# Altium schematic sheet ocxo.SchDoc: OCXO
size Letter; CheckedBy: J. Brinton; CompanyName: Signal Laboratories, Inc.; DrawnBy: J. Brinton; Engineer: J. Brinton; Address1: 3479 Edison Way; Address2: Menlo Park CA 94025; Address3: +1 (877) 778-8435; Address4: siglabs.com; Revision: 3; SheetNumber: 36; SheetTotal: 49
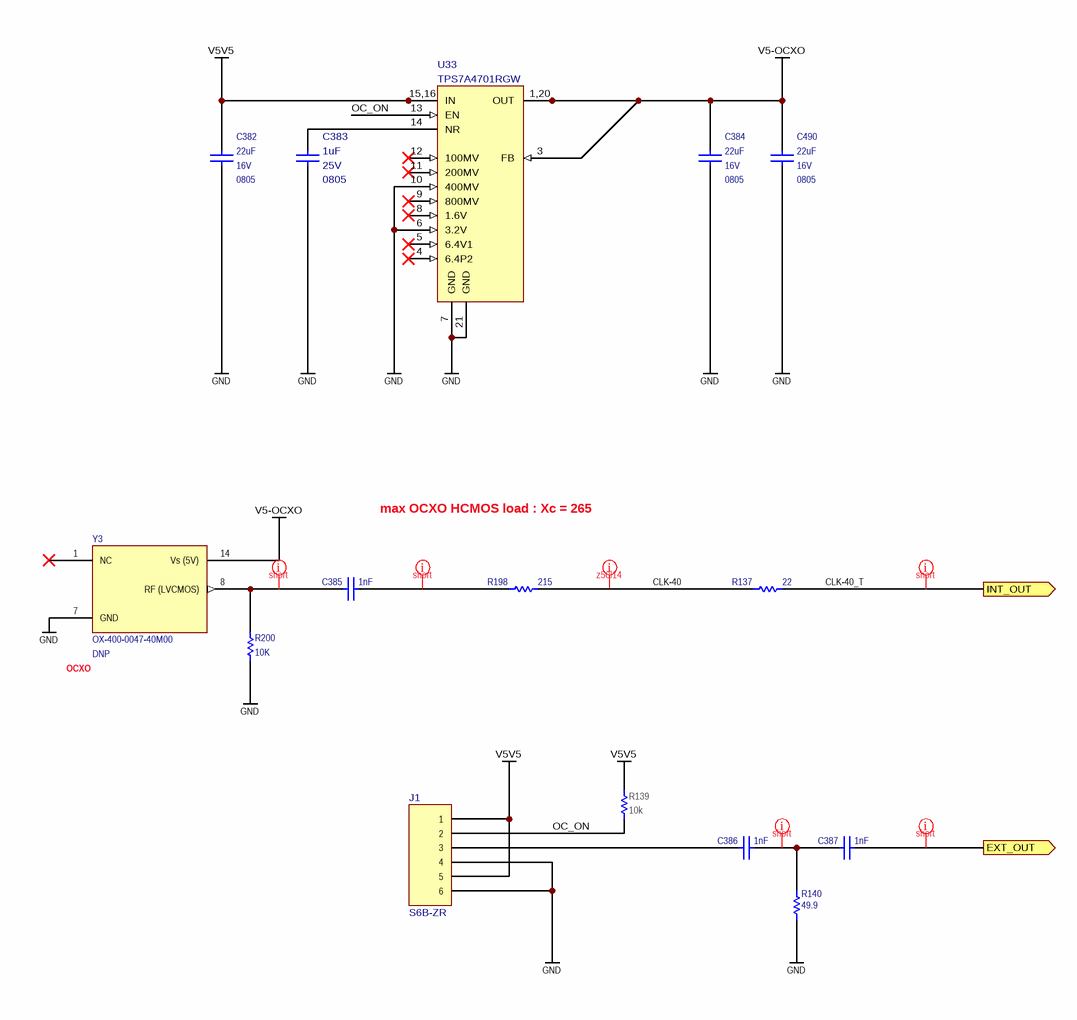
[diagram p0: ocxo.SchDoc]

## Parts
C382  value 22uF  Voltage: 16V  Package: 0805  [CAPC200X125X145L45N]  (hidden comment: CL21A226KOQNNNE)
C383  value 1uF  Package: 0805  Voltage: 25V  [CAPC200X125X145L45N]  (hidden comment: TMK212B7105KG)
C384  value 22uF  Voltage: 16V  Package: 0805  [CAPC200X125X145L45N]  (hidden comment: CL21A226KOQNNNE)
C385  value 1nF  [CAPC100X50X55L25N]  (hidden comment: CGA2B2NP01H102J050BA)
C386  value 1nF  [CAPC100X50X55L25N]  (hidden comment: CGA2B2NP01H102J050BA)
C387  value 1nF  [CAPC100X50X55L25N]  (hidden comment: CGA2B2NP01H102J050BA)
C490  value 22uF  Voltage: 16V  Package: 0805  [CAPC200X125X145L45N]  (hidden comment: CL21A226KOQNNNE)
J1  S6B-ZR  [S6B-ZR]
R137  value 22  [RESC1005X40N]  (hidden comment: RC0402FR-0722RL)
R139  value 10k  [RESC1005X40N]  (hidden comment: ERJ-2RKF1002X)
R140  value 49.9  [RESC1005X40N]  (hidden comment: ERA-2AEB49R9X)
R198  value 215  [RESC1005X40N]  (hidden comment: RC0402FR-07215RL)
R200  value 10K  [RESC1005X40N]  (hidden comment: ERJ-2RKF1002X)
U33  TPS7A4701RGW  [QFN65P500X500X100-21N]
Y3  OX-400-0047-40M00  Do Not Place: DNP  [G125]

## Ports
EXT_OUT (out), INT_OUT (out)

## Nets
GND: C382.1 C383.2 C384.1 C490.1 J1.4 J1.6 R140.2 R200.1 U33.6(3.2V) U33.7(GND) U33.10(400MV) U33.21(GND) Y3.7(GND)
V5-OCXO: C384.2 C490.2 U33.1(OUT) U33.3(FB) U33.20(OUT) Y3.14(Vs_(5V))
V5V5: C382.2 J1.1 J1.5 R139.2 U33.15(IN) U33.16(IN)
CLK-40: R137.1 R198.2
CLK-40_T: R137.2 ; port INT_OUT
EXT_OUT: C387.1 ; port EXT_OUT
OC_ON: J1.2 R139.1 U33.13(EN)
NetC383_1: C383.1 U33.14(NR)
NetC385_1: C385.1 R198.1
NetC385_2: C385.2 R200.2 Y3.8(RF_(LVCMOS))
NetC386_1: C386.1 C387.2 R140.1
NetC386_2: C386.2 J1.3

Not connected (* = marked no-connect by the designer): U33 4(6.4P2)* 5(6.4V1)* 8(1.6V)* 9(800MV)* 11(200MV)* 12(100MV)*; Y3 1(NC)*

## Layout directives
net class z50l14: CLK-40
net class short: CLK-40_T, EXT_OUT, NetC385_1, NetC385_2, NetC386_1

## Notes on the sheet
- max OCXO HCMOS load : Xc = 265
- (near Y3) OCXO
- Title
- Engineer
- Revision
- Drawn By
- Checked By
- Date
- Sheet
- of
- (in symbol TPS7A4701RGW_1) 15,16; 1,20

## Library data of the parts
C382 C384 C490 = CAP 0603: Ceramic Capacitor 22uF ±10% 16V X5R 0805; Manufacturer: Samsung; Tr: -55:85; Manufacturer P/N: CL21A226KOQNNNE; Tolerance: ±10%
C383 = TMK212B7105KG: Ceramic Capacitor 1uF ±10% 25V X7R 0805; Manufacturer: Taiyo Yuden; Manufacturer P/N: TMK212B7105KG; Tolerance: ±10%; Tr: *
C385-C387 = CAP 0402: Ceramic Capacitor 1nF ±5% 50V NP0 0402; Manufacturer: TDK; Tr: -55:150; Voltage: 50V; Manufacturer P/N: CGA2B2NP01H102J050BA; Package: 0402; Tolerance: ±5%
J1 = S6B-ZR: 1.5mm pitch right angle 6-position; Manufacturer: JST; Manufacturer P/N: S6B-ZR
R137 = RES 0402: Thick Film Resistor 22 ±1% 0402; Manufacturer: Yageo; Tr: -55:155; Package: 0402; Manufacturer P/N: RC0402FR-0722RL; Do Not Place: *; Tolerance: ±1%
R139 = RES: Thick Film Resistor 10k ±1% 0.1W 50V 0402; Manufacturer: Panasonic; Tcr: ±100; Tr: -55:155; Voltage: 50; Power: 0.1; Manufacturer P/N: ERJ-2RKF1002X; Tolerance: ±1%; Alternatives: *; Footprint: *; Package: 0402
R140 = RES 0402: Thin Film Resistor 49.9 ±0.1% 0402; Manufacturer: Panasonic; Tr: -55:155; Package: 0402; Manufacturer P/N: ERA-2AEB49R9X; Tolerance: ±0.1%
R198 = RES 0402: Thick Film Resistor 215 ±1% 0402; Manufacturer: Yageo; Tr: -55:155; Package: 0402; Manufacturer P/N: RC0402FR-07215RL; Do Not Place: *; Tolerance: ±1%
R200 = RES 0402: Thick Film Resistor 10k ±1% 0.1W 50V 0402; Manufacturer: Panasonic; Tr: -55:155; Package: 0402; Manufacturer P/N: ERJ-2RKF1002X; Tolerance: ±1%
U33 = TPS7A4701RGW_1: Low-Dropout Linear Regulator 20-VQFN; Manufacturer: Texas Instruments; Manufacturer P/N: TPS7A4701RGW; Package: VQFN-20
Y3 = OX-400-0047-40M00: Oven Controlled Precision Oscillator, 10MHz; Manufacturer: Vectron; Manufacturer P/N: OX-400-0047-40M00